# Altium project PMI_Action.PrjPCB
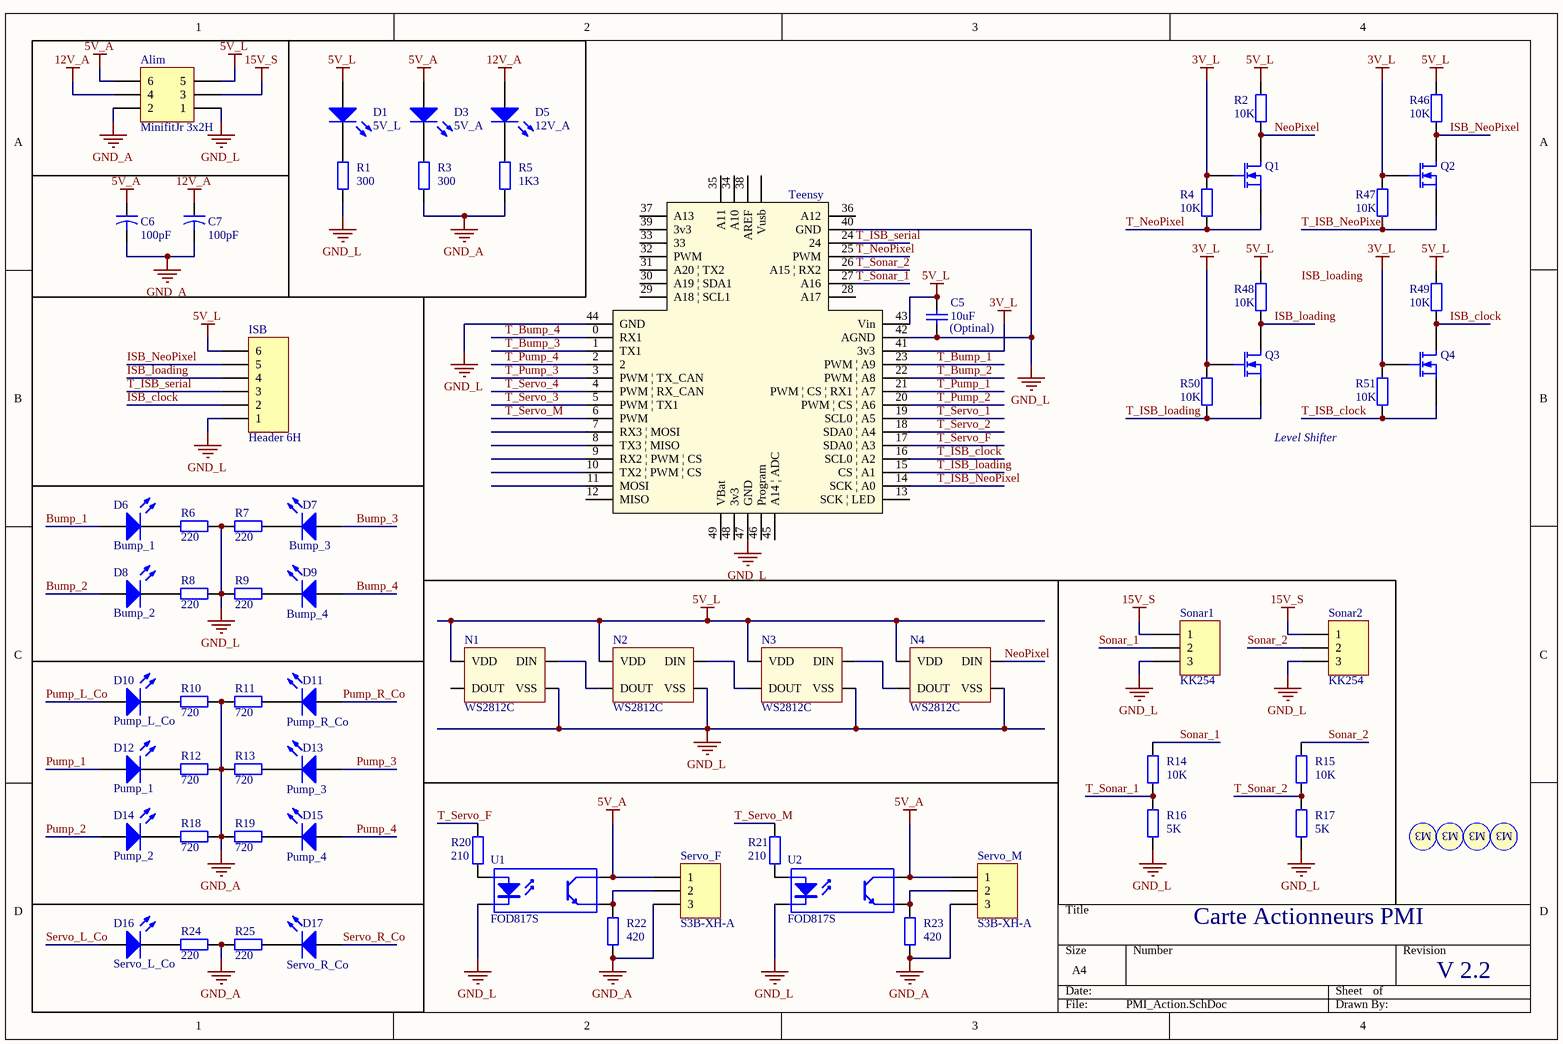
[diagram p0: PMI_Action.SchDoc]
2 sheets, 116 parts. Net scope: global (net labels, ports and power ports of the same name join across sheets).
Board file: PMI_Action.PcbDoc
Sheets:
  PMI_Action.SchDoc
  PMI_Action_Octopus.SchDoc

## Sheet PMI_Action.SchDoc
size A4

### Parts
Alim  MinifitJr 3x2H  [MOLEX_MINIFITJR_3X2]
C5  (Optinal)  value 10uF  [Capacitor 1206]
C6  value 100pF  [Condensateur]  (hidden comment: Cap2)
C7  value 100pF  [Condensateur]  (hidden comment: Cap2)
D1  5V_L  [KP-3216SEC]
D3  5V_A  [KP-3216SEC]
D5  12V_A  [KP-3216SEC]
D6  Bump_1  [KP-3216SEC]
D7  Bump_3  [KP-3216SEC]
D8  Bump_2  [KP-3216SEC]
D9  Bump_4  [KP-3216SEC]
D10  Pump_L_Co  [KP-3216SEC]
D11  Pump_R_Co  [KP-3216SEC]
D12  Pump_1  [KP-3216SEC]
D13  Pump_3  [KP-3216SEC]
D14  Pump_2  [KP-3216SEC]
D15  Pump_4  [KP-3216SEC]
D16  Servo_L_Co  [KP-3216SEC]
D17  Servo_R_Co  [KP-3216SEC]
ISB  Header 6H  [S6B-XH-A]
N1  WS2812C  [WS2812C]
N2  WS2812C  [WS2812C]
N3  WS2812C  [WS2812C]
N4  WS2812C  [WS2812C]
Q1  MOSFET-N  [SOT23_M]  (value not drawn)
Q2  MOSFET-N  [SOT23_M]  (value not drawn)
Q3  MOSFET-N  [SOT23_M]  (value not drawn)
Q4  MOSFET-N  [SOT23_M]  (value not drawn)
R1  value 300  [Resistor 1206]  (hidden comment: Res2)
R2  value 10K  [Resistor 1206]  (hidden comment: Res2)
R3  value 300  [Resistor 1206]  (hidden comment: Res2)
R4  value 10K  [Resistor 1206]  (hidden comment: Res2)
R5  value 1K3  [Resistor 1206]  (hidden comment: Res2)
R6  value 220  [Resistor 1206]  (hidden comment: Res2)
R7  value 220  [Resistor 1206]  (hidden comment: Res2)
R8  value 220  [Resistor 1206]  (hidden comment: Res2)
R9  value 220  [Resistor 1206]  (hidden comment: Res2)
R10  value 720  [Resistor 1206]  (hidden comment: Res2)
R11  value 720  [Resistor 1206]  (hidden comment: Res2)
R12  value 720  [Resistor 1206]  (hidden comment: Res2)
R13  value 720  [Resistor 1206]  (hidden comment: Res2)
R14  value 10K  [Resistor 1206]  (hidden comment: Res2)
R15  value 10K  [Resistor 1206]  (hidden comment: Res2)
R16  value 5K  [Resistor 1206]  (hidden comment: Res2)
R17  value 5K  [Resistor 1206]  (hidden comment: Res2)
R18  value 720  [Resistor 1206]  (hidden comment: Res2)
R19  value 720  [Resistor 1206]  (hidden comment: Res2)
R20  value 210  [Resistor 1206]  (hidden comment: Res2)
R21  value 210  [Resistor 1206]  (hidden comment: Res2)
R22  value 420  [Resistor 1206]  (hidden comment: Res2)
R23  value 420  [Resistor 1206]  (hidden comment: Res2)
R24  value 220  [Resistor 1206]  (hidden comment: Res2)
R25  value 220  [Resistor 1206]  (hidden comment: Res2)
R46  value 10K  [Resistor 1206]  (hidden comment: Res2)
R47  value 10K  [Resistor 1206]  (hidden comment: Res2)
R48  value 10K  [Resistor 1206]  (hidden comment: Res2)
R49  value 10K  [Resistor 1206]  (hidden comment: Res2)
R50  value 10K  [Resistor 1206]  (hidden comment: Res2)
R51  value 10K  [Resistor 1206]  (hidden comment: Res2)
S1  Screw M3  [Screw M3]  (value not drawn)
S2  Screw M3  [Screw M3]  (value not drawn)
S3  Screw M3  [Screw M3]  (value not drawn)
S4  Screw M3  [Screw M3]  (value not drawn)
Servo_F  S3B-XH-A  [S3B-XH-A]
Servo_M  S3B-XH-A  [S3B-XH-A]
Sonar1  KK254  [MOLEX KK254 3X1H M]
Sonar2  KK254  [MOLEX KK254 3X1H M]
Teensy  Teensy 3.2  [teensy]  (value not drawn)
U1  FOD817S  [SOP254P1016X385-4N]
U2  FOD817S  [SOP254P1016X385-4N]

### Nets
3V_L: Q1.2(G) Q2.2(G) Q3.2(G) Q4.2(G) R4.2 R47.2 R50.2 R51.2 Teensy.41(3v3)
5V_A: Alim.6 C6.1 D3.1(A) Servo_F.1 Servo_M.1 U1.4(C) U2.4(C)
5V_L: Alim.5 C5.2 D1.1(A) ISB.6 N1.1(VDD) N2.1(VDD) N3.1(VDD) N4.1(VDD) R2.2 R46.2 R48.2 R49.2 Teensy.43(Vin)
12V_A: Alim.4 C7.1 D5.1(A)
15V_S: Alim.3 Sonar1.1 Sonar2.1
GND_A: Alim.2 C6.2 C7.2 R3.2 R5.2 R10.2 R11.2 R12.2 R13.2 R18.2 R19.1 R22.1 R23.1 R24.2 R25.2 Servo_F.3 Servo_M.3
GND_L: Alim.1 C5.1 ISB.1 N1.3(VSS) N2.3(VSS) N3.3(VSS) N4.3(VSS) R1.1 R6.2 R7.2 R8.2 R9.1 R16.2 R17.2 Sonar1.3 Sonar2.3 Teensy.40(GND) Teensy.42(AGND) Teensy.44(GND) Teensy.47(GND) U1.2(K) U2.2(K)
Bump_1: D6.1(A) Teensy.23(PWM_|_A9)  [also labelled T_Bump_1]
Bump_2: D8.1(A) Teensy.22(PWM_|_A8)  [also labelled T_Bump_2]
Bump_3: D7.1(A) Teensy.1(TX1)  [also labelled T_Bump_3]
Bump_4: D9.1(A) Teensy.0(RX1)  [also labelled T_Bump_4]
ISB_clock: ISB.2 Q4.1(D) R49.1
ISB_loading: ISB.4 Q3.1(D) R48.1
ISB_NeoPixel: ISB.5 Q2.1(D) R46.1
NeoPixel: N4.4(DIN) Q1.1(D) R2.1
Pump_1: D12.1(A)
Pump_2: D14.1(A)
Pump_3: D13.1(A)
Pump_4: D15.1(A)
Pump_L_Co: D10.1(A)
Pump_R_Co: D11.1(A)
Servo_L_Co: D16.1(A)
Servo_R_Co: D17.1(A)
Sonar_1: R14.1 Sonar1.2
Sonar_2: R15.1 Sonar2.2
T_ISB_clock: Q4.3(S) R51.1 Teensy.16(SCL0_|_A2)
T_ISB_loading: Q3.3(S) R50.1 Teensy.15(CS_|_A1)
T_ISB_NeoPixel: Q2.3(S) R47.1 Teensy.14(SCK_|_A0)
T_ISB_serial: ISB.3 Teensy.24
T_NeoPixel: Q1.3(S) R4.1 Teensy.25(PWM)
T_Pump_1: Teensy.21(PWM_|_CS_|_RX1_|_A7)
T_Pump_2: Teensy.20(PWM_|_CS_|_A6)
T_Pump_3: Teensy.3(PWM_|_TX_CAN)
T_Pump_4: Teensy.2
T_Servo_1: Teensy.19(SCL0_|_A5)
T_Servo_2: Teensy.18(SDA0_|_A4)
T_Servo_3: Teensy.5(PWM_|_TX1)
T_Servo_4: Teensy.4(PWM_|_RX_CAN)
T_Servo_F: R20.2 Teensy.17(SDA0_|_A3)
T_Servo_M: R21.2 Teensy.6(PWM)
T_Sonar_1: R14.2 R16.1 Teensy.27(A16)
T_Sonar_2: R15.2 R17.1 Teensy.26(A15_|_RX2)
NetD1_2: D1.2(K) R1.2
NetD3_2: D3.2(K) R3.1
NetD5_2: D5.2(K) R5.1
NetD6_2: D6.2(K) R6.1
NetD7_2: D7.2(K) R7.1
NetD8_2: D8.2(K) R8.1
NetD9_2: D9.2(K) R9.2
NetD10_2: D10.2(K) R10.1
NetD11_2: D11.2(K) R11.1
NetD12_2: D12.2(K) R12.1
NetD13_2: D13.2(K) R13.1
NetD14_2: D14.2(K) R18.1
NetD15_2: D15.2(K) R19.2
NetD16_2: D16.2(K) R24.1
NetD17_2: D17.2(K) R25.1
NetN1_4: N1.4(DIN) N2.2(DOUT)
NetN2_4: N2.4(DIN) N3.2(DOUT)
NetN3_4: N3.4(DIN) N4.2(DOUT)
NetR20_1: R20.1 U1.1(A)
NetR21_1: R21.1 U2.1(A)
NetR22_2: R22.2 Servo_F.2 U1.3(E)
NetR23_2: R23.2 Servo_M.2 U2.3(E)

Not connected (* = marked no-connect by the designer): N1 2(DOUT); Teensy 7(RX3_|_MOSI) 8(TX3_|_MISO) 9(RX2_|_PWM_|_CS) 10(TX2_|_PWM_|_CS) 11(MOSI) 12(MISO) 13(SCK_|_LED) 28(A17) 29(A18_|_SCL1) 30(A19_|_SDA1) 31(A20_|_TX2) 32(PWM) 33 34(A10) 35(A11) 36(A12) 37(A13) 38(AREF) 39(3v3) 45(A14_|_ADC) 46(Program) 48(3v3) 49(VBat) 50(Vusb)

### Notes on the sheet
- Level Shifter
- Carte Actionneurs PMI
- V 2.2
- Labels drawn without touching a wire or pin: ISB_loading
- (in symbol Screw M3) M3

### Library data of the parts
Alim = Header 3X2H: Header, 3-Pin, Dual row, Right Angle; LatestRevisionDate: 17-Jul-2002; LatestRevisionNote: Re-released for DXP Platform.; Publisher: Altium Limited
C5 = Cap: Capacitor; Published: 8-Jun-2000; LatestRevisionDate: 17-Jul-2002; LatestRevisionNote: Re-released for DXP Platform.; PackageReference: RAD-0.3; Publisher: Altium Limited; PackageDescription: Radial Cap, Thru-Hole; 2 Leads; 0.3 in Pin Spacing
C6 C7 = Cap2: Capacitor; Published: 23-Sep-2002; PackageReference: CAPR5-4X5; Publisher: Altium Limited; PackageDescription: Capacitor; 2 Leads
D1 D3 D5-D17 = LED2: Typical RED, GREEN, YELLOW, AMBER GaAs LED; Published: 8-Jun-2000; LatestRevisionDate: 17-Jul-2002; LatestRevisionNote: Re-released for DXP Platform.; PackageVersion: Feb-2002; PackageReference: 3.2X1.6X1.1; Publisher: Altium Limited; PackageDescription: SM LED; 2 Flat Leads
ISB = Header 6H: Header, 6-Pin, Right Angle; LatestRevisionDate: 17-Jul-2002; LatestRevisionNote: Re-released for DXP Platform.; Publisher: Altium Limited
N1-N4 = WS2812C: Intelligent control LED
Q1-Q4 = MOSFET-N: N-Channel MOSFET; pin to pad: 2>3 3>2; Published: 8-Jun-2000; LatestRevisionDate: 17-Jul-2002; LatestRevisionNote: Re-released for DXP Platform.; PackageVersion: 1995/1996; PackageReference: E3; Publisher: Altium Limited; PackageDescription: TO, Flat Index; 3 In-Line, Axial Leads; Body Dia. 4.6mm; Lead Dia. 0.5 mm (max)
R1-R25 R46-R51 = Res2: Resistor; Published: 8-Jun-2000; LatestRevisionDate: 17-Jul-2002; LatestRevisionNote: Re-released for DXP Platform.; PackageReference: AXIAL-0.4; Publisher: Altium Limited; PackageDescription: Axial Device, Thru-Hole; 2 Leads; 0.4 in Pin Spacing
Servo_F Servo_M Sonar1 Sonar2 = Header 3H: Header, 3-Pin, Right Angle; LatestRevisionDate: 17-Jul-2002; LatestRevisionNote: Re-released for DXP Platform.; Publisher: Altium Limited
Teensy = teensy3.2
U1 U2 = Optoisolator1: 4-Pin Phototransistor Optocoupler; Published: 24-Mar-1999; LatestRevisionDate: 04-Mar-2005; LatestRevisionNote: Sch pins 3 & 4 Swapped.; DatasheetVersion: Nov-2003; PackageReference: DIP-4; Publisher: Altium Limited

## Sheet PMI_Action_Octopus.SchDoc
size A4
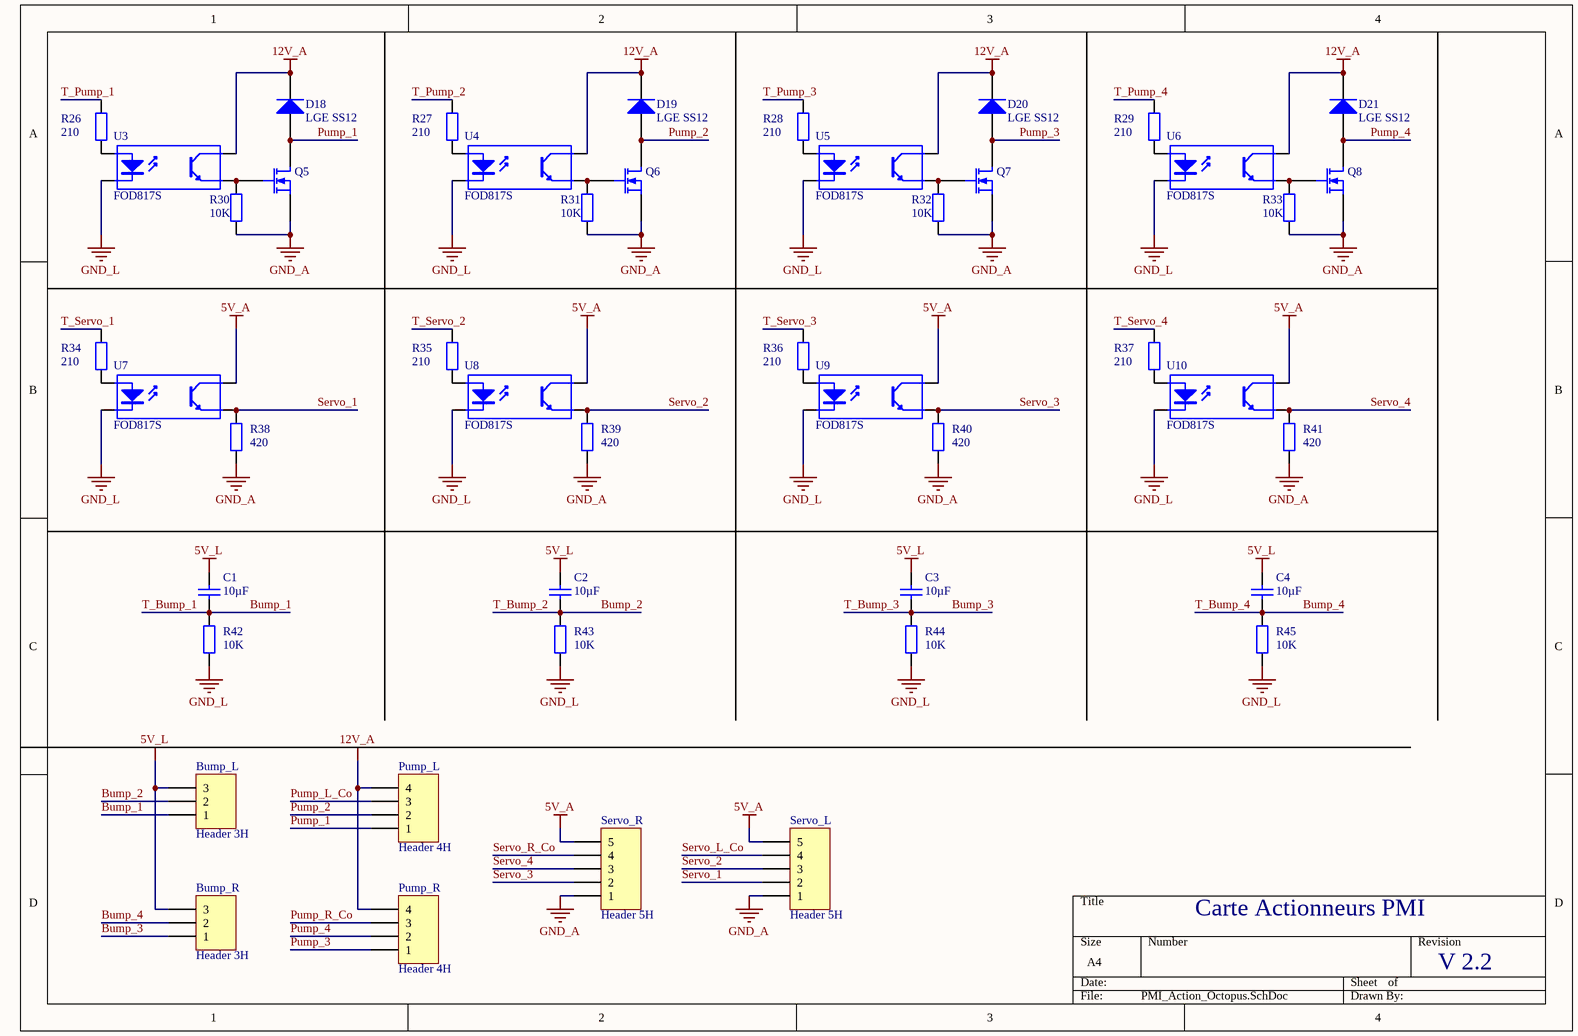
[diagram p1: PMI_Action_Octopus.SchDoc]

### Parts
Bump_L  Header 3H  [S3B-XH-A]
Bump_R  Header 3H  [S3B-XH-A]
C1  value 10µF  [Capacitor 1206]
C2  value 10µF  [Capacitor 1206]
C3  value 10µF  [Capacitor 1206]
C4  value 10µF  [Capacitor 1206]
D18  LGE SS12  [SMB]
D19  LGE SS12  [SMB]
D20  LGE SS12  [SMB]
D21  LGE SS12  [SMB]
Pump_L  Header 4H  [S4B-XH-A]
Pump_R  Header 4H  [S4B-XH-A]
Q5  MOSFET-N  [SOT23_M]  (value not drawn)
Q6  MOSFET-N  [SOT23_M]  (value not drawn)
Q7  MOSFET-N  [SOT23_M]  (value not drawn)
Q8  MOSFET-N  [SOT23_M]  (value not drawn)
R26  value 210  [Resistor 1206]  (hidden comment: Res2)
R27  value 210  [Resistor 1206]  (hidden comment: Res2)
R28  value 210  [Resistor 1206]  (hidden comment: Res2)
R29  value 210  [Resistor 1206]  (hidden comment: Res2)
R30  value 10K  [Resistor 1206]  (hidden comment: Res2)
R31  value 10K  [Resistor 1206]  (hidden comment: Res2)
R32  value 10K  [Resistor 1206]  (hidden comment: Res2)
R33  value 10K  [Resistor 1206]  (hidden comment: Res2)
R34  value 210  [Resistor 1206]  (hidden comment: Res2)
R35  value 210  [Resistor 1206]  (hidden comment: Res2)
R36  value 210  [Resistor 1206]  (hidden comment: Res2)
R37  value 210  [Resistor 1206]  (hidden comment: Res2)
R38  value 420  [Resistor 1206]  (hidden comment: Res2)
R39  value 420  [Resistor 1206]  (hidden comment: Res2)
R40  value 420  [Resistor 1206]  (hidden comment: Res2)
R41  value 420  [Resistor 1206]  (hidden comment: Res2)
R42  value 10K  [Resistor 1206]  (hidden comment: Res2)
R43  value 10K  [Resistor 1206]  (hidden comment: Res2)
R44  value 10K  [Resistor 1206]  (hidden comment: Res2)
R45  value 10K  [Resistor 1206]  (hidden comment: Res2)
Servo_L  Header 5H  [S5B-XH-A]
Servo_R  Header 5H  [S5B-XH-A]
U3  FOD817S  [SOP254P1016X385-4N]
U4  FOD817S  [SOP254P1016X385-4N]
U5  FOD817S  [SOP254P1016X385-4N]
U6  FOD817S  [SOP254P1016X385-4N]
U7  FOD817S  [SOP254P1016X385-4N]
U8  FOD817S  [SOP254P1016X385-4N]
U9  FOD817S  [SOP254P1016X385-4N]
U10  FOD817S  [SOP254P1016X385-4N]

### Nets
5V_A: Servo_L.5 Servo_R.5 U7.4(C) U8.4(C) U9.4(C) U10.4(C)
5V_L: Bump_L.3 Bump_R.3 C1.2 C2.2 C3.2 C4.2
12V_A: D18.2(K) D19.2(K) D20.2(K) D21.2(K) Pump_L.4 Pump_R.4 U3.4(C) U4.4(C) U5.4(C) U6.4(C)
GND_A: Q5.3(S) Q6.3(S) Q7.3(S) Q8.3(S) R30.1 R31.1 R32.1 R33.1 R38.1 R39.1 R40.1 R41.1 Servo_L.1 Servo_R.1
GND_L: R42.1 R43.1 R44.1 R45.1 U3.2(K) U4.2(K) U5.2(K) U6.2(K) U7.2(K) U8.2(K) U9.2(K) U10.2(K)
Bump_1: Bump_L.1 C1.1 R42.2  [also labelled T_Bump_1]
Bump_2: Bump_L.2 C2.1 R43.2  [also labelled T_Bump_2]
Bump_3: Bump_R.1 C3.1 R44.2  [also labelled T_Bump_3]
Bump_4: Bump_R.2 C4.1 R45.2  [also labelled T_Bump_4]
Pump_1: D18.1(A) Pump_L.1 Q5.1(D)
Pump_2: D19.1(A) Pump_L.2 Q6.1(D)
Pump_3: D20.1(A) Pump_R.1 Q7.1(D)
Pump_4: D21.1(A) Pump_R.2 Q8.1(D)
Pump_L_Co: Pump_L.3
Pump_R_Co: Pump_R.3
Servo_1: R38.2 Servo_L.2 U7.3(E)
Servo_2: R39.2 Servo_L.3 U8.3(E)
Servo_3: R40.2 Servo_R.2 U9.3(E)
Servo_4: R41.2 Servo_R.3 U10.3(E)
Servo_L_Co: Servo_L.4
Servo_R_Co: Servo_R.4
T_Pump_1: R26.2
T_Pump_2: R27.2
T_Pump_3: R28.2
T_Pump_4: R29.2
T_Servo_1: R34.2
T_Servo_2: R35.2
T_Servo_3: R36.2
T_Servo_4: R37.2
NetQ5_2: Q5.2(G) R30.2 U3.3(E)
NetQ6_2: Q6.2(G) R31.2 U4.3(E)
NetQ7_2: Q7.2(G) R32.2 U5.3(E)
NetQ8_2: Q8.2(G) R33.2 U6.3(E)
NetR26_1: R26.1 U3.1(A)
NetR27_1: R27.1 U4.1(A)
NetR28_1: R28.1 U5.1(A)
NetR29_1: R29.1 U6.1(A)
NetR34_1: R34.1 U7.1(A)
NetR35_1: R35.1 U8.1(A)
NetR36_1: R36.1 U9.1(A)
NetR37_1: R37.1 U10.1(A)

### Notes on the sheet
- Carte Actionneurs PMI
- V 2.2

### Library data of the parts
Bump_L Bump_R = Header 3H: Header, 3-Pin, Right Angle; LatestRevisionDate: 17-Jul-2002; LatestRevisionNote: Re-released for DXP Platform.; Publisher: Altium Limited
C1-C4 = Cap: Capacitor; Published: 8-Jun-2000; LatestRevisionDate: 17-Jul-2002; LatestRevisionNote: Re-released for DXP Platform.; PackageReference: RAD-0.3; Publisher: Altium Limited; PackageDescription: Radial Cap, Thru-Hole; 2 Leads; 0.3 in Pin Spacing
D18-D21 = Diode: Default Diode; Published: 8-Jun-2000; LatestRevisionDate: 17-Jul-2002; LatestRevisionNote: Re-released for DXP Platform.; PackageVersion: Sep-1996; PackageReference: SMC; Publisher: Altium Limited; PackageDescription: DO-214-AB/SMC; 2 C-Bend Leads; Body 7.9 x 5.9 mm, inc. leads (LxW); Code_JEDEC: DO-214-AB
Pump_L Pump_R = Header 4H: Header, 4-Pin, Right Angle; LatestRevisionDate: 17-Jul-2002; LatestRevisionNote: Re-released for DXP Platform.; Publisher: Altium Limited
Q5-Q8 = MOSFET-N: N-Channel MOSFET; pin to pad: 2>3 3>2; Published: 8-Jun-2000; LatestRevisionDate: 17-Jul-2002; LatestRevisionNote: Re-released for DXP Platform.; PackageVersion: 1995/1996; PackageReference: E3; Publisher: Altium Limited; PackageDescription: TO, Flat Index; 3 In-Line, Axial Leads; Body Dia. 4.6mm; Lead Dia. 0.5 mm (max)
R26-R45 = Res2: Resistor; Published: 8-Jun-2000; LatestRevisionDate: 17-Jul-2002; LatestRevisionNote: Re-released for DXP Platform.; PackageReference: AXIAL-0.4; Publisher: Altium Limited; PackageDescription: Axial Device, Thru-Hole; 2 Leads; 0.4 in Pin Spacing
Servo_L Servo_R = Header 5H: Header, 5-Pin, Right Angle; LatestRevisionDate: 17-Jul-2002; LatestRevisionNote: Re-released for DXP Platform.; Publisher: Altium Limited
U3-U10 = Optoisolator1: 4-Pin Phototransistor Optocoupler; Published: 24-Mar-1999; LatestRevisionDate: 04-Mar-2005; LatestRevisionNote: Sch pins 3 & 4 Swapped.; DatasheetVersion: Nov-2003; PackageReference: DIP-4; Publisher: Altium Limited

## Nets that join several sheets
5V_A: PMI_Action (7 pins), PMI_Action_Octopus (6 pins)
5V_L: PMI_Action (13 pins), PMI_Action_Octopus (6 pins)
12V_A: PMI_Action (Alim.4 C7.1 D5.1), PMI_Action_Octopus (10 pins)
GND_A: PMI_Action (17 pins), PMI_Action_Octopus (14 pins)
GND_L: PMI_Action (22 pins), PMI_Action_Octopus (12 pins)
Bump_1: PMI_Action (D6.1 Teensy.23), PMI_Action_Octopus (Bump_L.1 C1.1 R42.2)
Bump_2: PMI_Action (D8.1 Teensy.22), PMI_Action_Octopus (Bump_L.2 C2.1 R43.2)
Bump_3: PMI_Action (D7.1 Teensy.1), PMI_Action_Octopus (Bump_R.1 C3.1 R44.2)
Bump_4: PMI_Action (D9.1 Teensy.0), PMI_Action_Octopus (Bump_R.2 C4.1 R45.2)
Pump_1: PMI_Action (D12.1), PMI_Action_Octopus (D18.1 Pump_L.1 Q5.1)
Pump_2: PMI_Action (D14.1), PMI_Action_Octopus (D19.1 Pump_L.2 Q6.1)
Pump_3: PMI_Action (D13.1), PMI_Action_Octopus (D20.1 Pump_R.1 Q7.1)
Pump_4: PMI_Action (D15.1), PMI_Action_Octopus (D21.1 Pump_R.2 Q8.1)
Pump_L_Co: PMI_Action (D10.1), PMI_Action_Octopus (Pump_L.3)
Pump_R_Co: PMI_Action (D11.1), PMI_Action_Octopus (Pump_R.3)
Servo_L_Co: PMI_Action (D16.1), PMI_Action_Octopus (Servo_L.4)
Servo_R_Co: PMI_Action (D17.1), PMI_Action_Octopus (Servo_R.4)
T_Pump_1: PMI_Action (Teensy.21), PMI_Action_Octopus (R26.2)
T_Pump_2: PMI_Action (Teensy.20), PMI_Action_Octopus (R27.2)
T_Pump_3: PMI_Action (Teensy.3), PMI_Action_Octopus (R28.2)
T_Pump_4: PMI_Action (Teensy.2), PMI_Action_Octopus (R29.2)
T_Servo_1: PMI_Action (Teensy.19), PMI_Action_Octopus (R34.2)
T_Servo_2: PMI_Action (Teensy.18), PMI_Action_Octopus (R35.2)
T_Servo_3: PMI_Action (Teensy.5), PMI_Action_Octopus (R36.2)
T_Servo_4: PMI_Action (Teensy.4), PMI_Action_Octopus (R37.2)